# Altium project MSP-EXP430F5529LP.PrjPcb
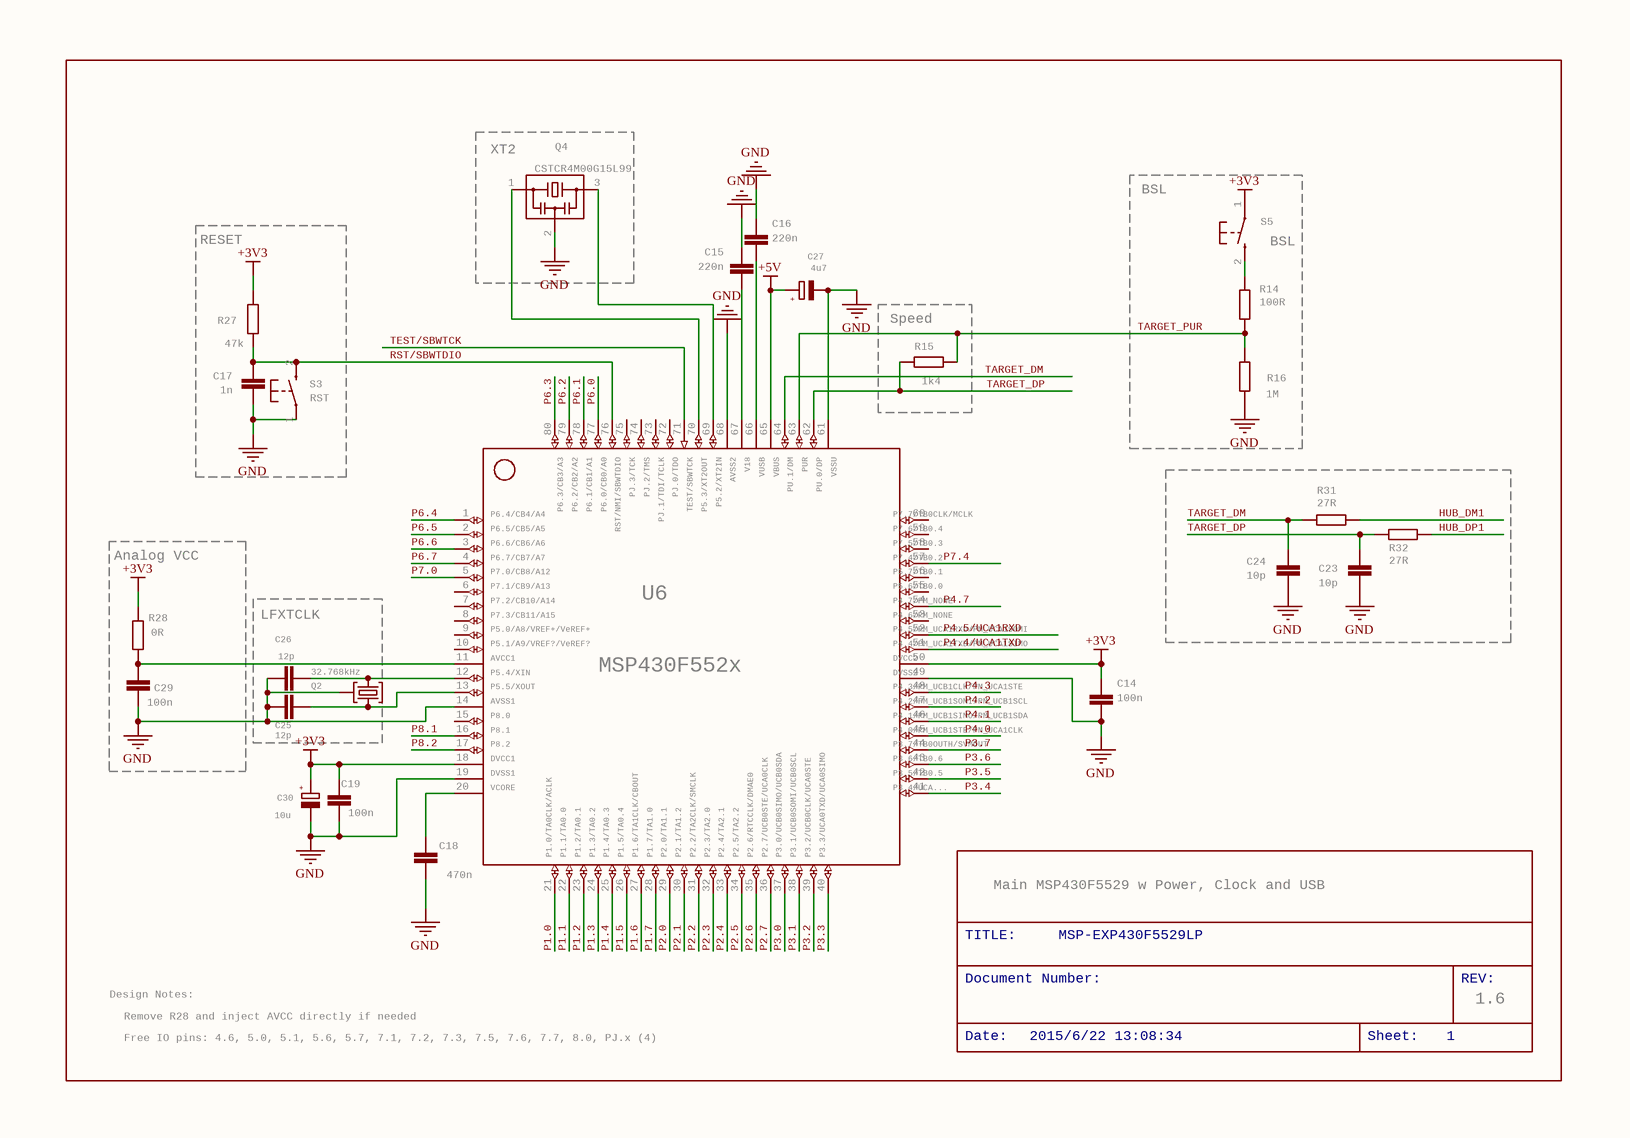
[diagram p0: MSP-EXP430F5529LP_0.SchDoc]
4 sheets, 129 parts. Net scope: global (net labels, ports and power ports of the same name join across sheets).
Board file: MSP-EXP430F5529LP.PcbDoc
Sheets:
  MSP-EXP430F5529LP_0.SchDoc
  MSP-EXP430F5529LP_1.SchDoc
  MSP-EXP430F5529LP_2.SchDoc
  MSP-EXP430F5529LP_3.SchDoc

## Sheet MSP-EXP430F5529LP_0.SchDoc: MSP-EXP430F5529LP
size 286 x 199 mm; Date: 2015/6/22 13:08:34; SheetNumber: 1; Origin: Eagle; GateName_1: G$1; SymbolName_1: DINA4_L; LibraryName: MSP-EXP430F5659; DeviceSetName: DINA4_L; GateName_2: G$2; SymbolName_2: DOCFIELD; Sheet: Sheet:; REV: REV:

### Parts
C14  100n  [0402]
C15  220n  [0402]
C16  220n  [0402]
C17  1n  [0402]
C18  470n  [0402]
C19  100n  [0402]
C23  10p  [0402]
C24  10p  [0402]
C25  12p  [0402]
C26  12p  [0402]
C27  4u7  [A/3216-18R]
C29  100n  [0402]
C30  10u  [A/3216-18R]
Q2  32.768kHz  [MS3V-T1R]
Q4  CSTCR4M00G15L99  [MURATA-FILTER_CSTCR]
R14  100R  [0402]
R15  1k4  [0402]
R16  1M  [0402]
R27  47k  [0402]
R28  0R  [0402]
R31  27R  [0402]
R32  27R  [0402]
S3  RST  [PBTH]
S5  BSL  [PBTH]
U6  MSP430F5529IPNR  [PN80]  (value not drawn)

### Blocks framed on the sheet
XT2: Q4
BSL: R14 R16 S5
RESET: C17 R27 S3
Speed: R15
Analog VCC: C29 R28
LFXTCLK: C25 C26 Q2

### Nets
+3V3: C14.1 C19.2 C30.+ R27.2 R28.2 S5.1(P) U6.18 U6.50
+5V: C27.+ U6.65
GND: C14.2 C15.2 C16.2 C17.2 C18.1 C19.1 C23.2 C24.2 C25.1 C26.1 C27.- C29.2 C30.- Q2.P3(GND) Q4.2 R16.1 S3.1(P) U6.14 U6.19 U6.49 U6.61 U6.68
HUB_DM1: R31.1
HUB_DP1: R32.1
P1.0: U6.21
P1.1: U6.22
P1.2: U6.23
P1.3: U6.24
P1.4: U6.25
P1.5: U6.26
P1.6: U6.27
P1.7: U6.28
P2.0: U6.29
P2.1: U6.30
P2.2: U6.31
P2.3: U6.32
P2.4: U6.33
P2.5: U6.34
P2.6: U6.35
P2.7: U6.36
P3.0: U6.37
P3.1: U6.38
P3.2: U6.39
P3.3: U6.40
P3.4: U6.41
P3.5: U6.42
P3.6: U6.43
P3.7: U6.44
P4.0: U6.45
P4.1: U6.46
P4.2: U6.47
P4.3: U6.48
P4.4/UCA1TXD: U6.51
P4.5/UCA1RXD: U6.52
P4.7: U6.54
P6.0: U6.77
P6.1: U6.78
P6.2: U6.79
P6.3: U6.80
P6.4: U6.1
P6.5: U6.2
P6.6: U6.3
P6.7: U6.4
P7.0: U6.5
P7.4: U6.57
P8.1: U6.16
P8.2: U6.17
RST/SBWTDIO: C17.1 R27.1 S3.2(S) U6.76
TARGET_DM: C24.1 R31.2 U6.64
TARGET_DP: C23.1 R15.2 R32.2 U6.62
TARGET_PUR: R14.2 R15.1 R16.2 U6.63
TEST/SBWTCK: U6.71
NetC15_1: C15.1 U6.67
NetC16_1: C16.1 U6.66
NetC18_2: C18.2 U6.20
NetC25_2: C25.2 Q2.P1 U6.13
NetC26_2: C26.2 Q2.P2 U6.12
NetC29_1: C29.1 R28.1 U6.11
NetQ4_1: Q4.1 U6.70
NetQ4_3: Q4.3 U6.69
NetR14_1: R14.1 S5.2(S)

Not connected (* = marked no-connect by the designer): U6 6 7 8 9 10 15 53 55 56 58 59 60 72 73 74 75

### Notes on the sheet
- TITLE:
- Main MSP430F5529 w Power, Clock and USB
- MSP-EXP430F5529LP
- Design Notes:
- Remove R28 and inject AVCC directly if needed
- Document Number:
- REV:
- 1.6
- Free IO pins: 4.6, 5.0, 5.1, 5.6, 5.7, 7.1, 7.2, 7.3, 7.5, 7.6, 7.7, 8.0, PJ.x (4)
- Date:
- 2015/6/22 13:08:34
- Sheet:
- 1

### Library data of the parts
C14-C19 C23-C26 C29 = C-EUCM0402: CAPACITOR, European symbol; GateName_1: G$1; SymbolName_1: C-EU; DeviceName: CM0402; LibraryName: rcl; DeviceSetName: C-EU
C27 C30 = CPOL-EUA/3216-18R: POLARIZED CAPACITOR, European symbol; GateName_1: G$1; SymbolName_1: CPOL; DeviceName: A/3216-18R; LibraryName: rcl; DeviceSetName: CPOL-EU; +: +
Q2 = MS3V-T1R: GateName_1: >NAME; SymbolName_1: CRYSTAL_W_METALHOUSING; LibraryName: microcrystal; DeviceSetName: MS3V-T1R
Q4 = MURATA-FILTER_CSTCR: Resonator   Source: murata.co.jp; MPN: CSTCR6M00G53-R0; GateName_1: G$1; SymbolName_1: MURATA-FILTER_CST; LibraryName: murata; DeviceSetName: MURATA-FILTER_CSTCR; MF: MF; OC_FARNELL: 1170434; OC_NEWARK: 25M8759
R14-R16 R27 R28 R31 R32 = R-EU_RM0402: RESISTOR, European symbol; GateName_1: G$1; SymbolName_1: R-EU; DeviceName: RM0402; DeviceSetName: R-EU_; LibraryName: rcl
S3 S5 = PB: OMRON SWITCH; GateName_1: G$1; SymbolName_1: PB; LibraryName: electricalmeter; DeviceSetName: PB
U6 = F552X---PN80: ***MSP430F552X***PN80 http://www.ti.com/lit/gpn/msp430f5529 Rev1.0 06/2010    For F552X where X is 1,5,7,9; GateName_1: G$1; SymbolName_1: F552X---PN80; LibraryName: TI_MSP430_v16_intern; DeviceSetName: F552X---PN80; P6.3/CB3/A3: P6.3/CB3/A3; P6.2/CB2/A2: P6.2/CB2/A2; P6.1/CB1/A1: P6.1/CB1/A1; P6.0/CB0/A0: P6.0/CB0/A0; PJ.3/TCK: PJ.3/TCK; PJ.2/TMS: PJ.2/TMS; PJ.1/TDI/TCLK: PJ.1/TDI/TCLK; PJ.0/TDO: PJ.0/TDO; TEST/SBWTCK: TEST/SBWTCK; P5.3/XT2OUT: P5.3/XT2OUT; P5.2/XT2IN: P5.2/XT2IN; AVSS2: AVSS2; V18: V18; VUSB: VUSB; VBUS: VBUS; PU.1/DM: PU.1/DM; PUR: PUR; PU.0/DP: PU.0/DP; VSSU: VSSU; RST/NMI/SBWTDIO: RST/NMI/SBWTDIO; P7.7/TB0CLK/MCLK: P7.7/TB0CLK/MCLK; P7.6/TB0.4: P7.6/TB0.4; P7.5/TB0.3: P7.5/TB0.3; P7.4/TB0.2: P7.4/TB0.2; P5.7/TB0.1: P5.7/TB0.1; P5.6/TB0.0: P5.6/TB0.0; P4.7/PM_NONE: P4.7/PM_NONE; P4.5/PM_UCA1RXD/PM_UCA1SOMI: P4.5/PM_UCA1RXD/PM_UCA1SOMI; P4.4/PM_UCA1TXD/PM_UCA1SIMO: P4.4/PM_UCA1TXD/PM_UCA1SIMO; DVCC2: DVCC2; P4.3/PM_UCB1CLK/PM_UCA1STE: P4.3/PM_UCB1CLK/PM_UCA1STE; P4.2/PM_UCB1SOMI/PM_UCB1SCL: P4.2/PM_UCB1SOMI/PM_UCB1SCL; P4.1/PM_UCB1SIMO/PM_UCB1SDA: P4.1/PM_UCB1SIMO/PM_UCB1SDA; P4.0/PM_UCB1STE/PM_UCA1CLK: P4.0/PM_UCB1STE/PM_UCA1CLK; P3.7/TB0OUTH/SVMOUT: P3.7/TB0OUTH/SVMOUT; P3.6/TB0.6: P3.6/TB0.6; P4.6/PM_NONE: P4.6/PM_NONE; P3.5/TB0.5: P3.5/TB0.5; P3.4/UCA...: P3.4/UCA...; P1.0/TA0CLK/ACLK: P1.0/TA0CLK/ACLK; P1.1/TA0.0: P1.1/TA0.0; P1.2/TA0.1: P1.2/TA0.1; P1.3/TA0.2: P1.3/TA0.2; P1.4/TA0.3: P1.4/TA0.3; P1.5/TA0.4: P1.5/TA0.4; P1.6/TA1CLK/CBOUT: P1.6/TA1CLK/CBOUT; P1.7/TA1.0: P1.7/TA1.0; P2.0/TA1.1: P2.0/TA1.1; P2.1/TA1.2: P2.1/TA1.2; P2.2/TA2CLK/SMCLK: P2.2/TA2CLK/SMCLK; P2.4/TA2.1: P2.4/TA2.1; P2.5/TA2.2: P2.5/TA2.2; P2.6/RTCCLK/DMAE0: P2.6/RTCCLK/DMAE0; P2.7/UCB0STE/UCA0CLK: P2.7/UCB0STE/UCA0CLK; P3.0/UCB0SIMO/UCB0SDA: P3.0/UCB0SIMO/UCB0SDA; P3.1/UCB0SOMI/UCB0SCL: P3.1/UCB0SOMI/UCB0SCL; P3.2/UCB0CLK/UCA0STE: P3.2/UCB0CLK/UCA0STE; P3.3/UCA0TXD/UCA0SIMO: P3.3/UCA0TXD/UCA0SIMO; P6.4/CB4/A4: P6.4/CB4/A4; P6.5/CB5/A5: P6.5/CB5/A5; P6.6/CB6/A6: P6.6/CB6/A6; P6.7/CB7/A7: P6.7/CB7/A7; P7.0/CB8/A12: P7.0/CB8/A12; P7.1/CB9/A13: P7.1/CB9/A13; P7.2/CB10/A14: P7.2/CB10/A14; P7.3/CB11/A15: P7.3/CB11/A15; P5.0/A8/VREF+/VeREF+: P5.0/A8/VREF+/VeREF+; P5.1/A9/VREF?/VeREF?: P5.1/A9/VREF?/VeREF?; AVCC1: AVCC1; P5.4/XIN: P5.4/XIN; P5.5/XOUT: P5.5/XOUT; AVSS1: AVSS1; P8.0: P8.0; P8.1: P8.1; P8.2: P8.2; DVCC1: DVCC1; DVSS1: DVSS1; VCORE: VCORE; MSP430F552x: MSP430F552x; DVSS2: DVSS2; P2.3/TA2.0: P2.3/TA2.0

## Sheet MSP-EXP430F5529LP_1.SchDoc: MSP-EXP430F5529LP
size 286 x 199 mm; Date: 2015/6/22 13:08:34; SheetNumber: 2; Origin: Eagle; GateName_1: G$1; SymbolName_1: DINA4_L; LibraryName: MSP-EXP430F5659; DeviceSetName: DINA4_L; GateName_2: G$2; SymbolName_2: DOCFIELD; Sheet: Sheet:; REV: REV:
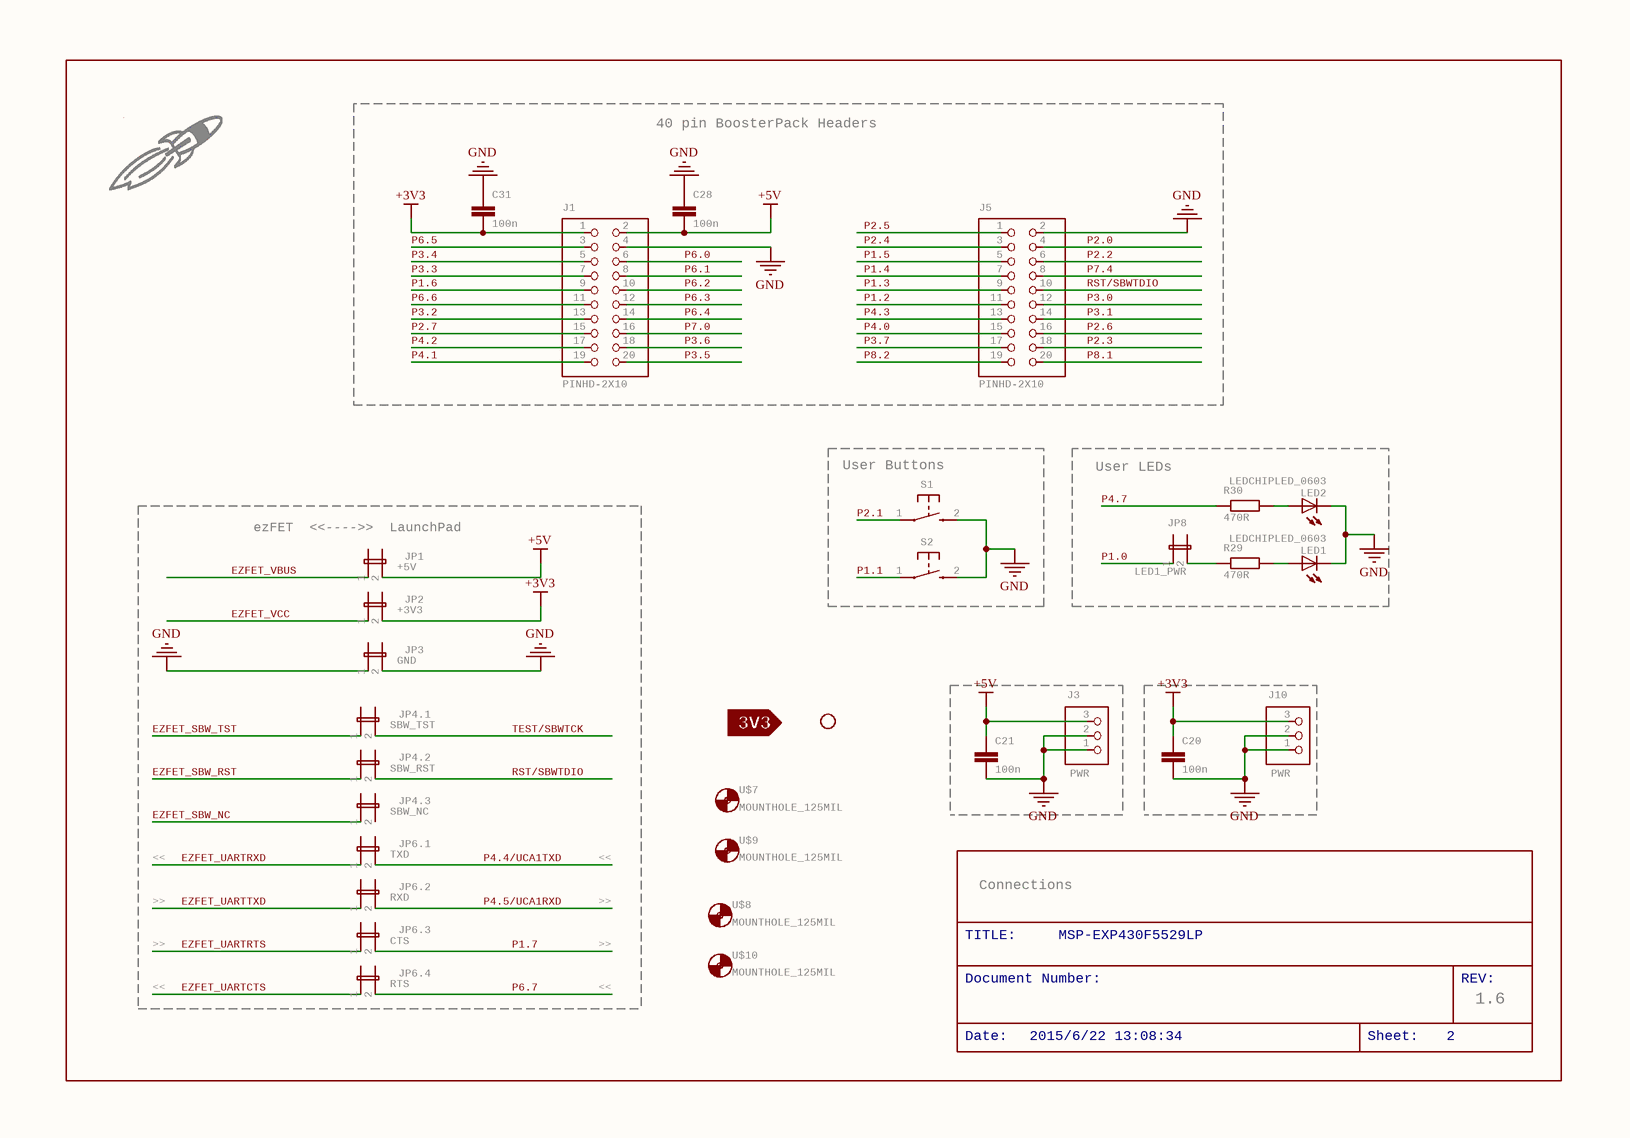
[diagram p1: MSP-EXP430F5529LP_1.SchDoc]

### Parts
C20  100n  [0402]
C21  100n  [0402]
C28  100n  [0402]
C31  100n  [0402]
DRAW1  LOGO-ROCKET-20X13MM-SCH-S  [LOGO-ROCKET-10X7MM-BRD]  (value not drawn)
J1  PINHD-2X10  [2X10]
J3  PWR  [1X03]
J5  PINHD-2X10  [2X10]
J10  PWR  [1X03]
JP1  +5V  [JP1M]
JP2  +3V3  [JP1M]
JP3  GND  [JP1M]
JP4.1  SBW_TST  [JP1M]
JP4.2  SBW_RST  [JP1M]
JP4.3  SBW_NC  [JP1M]
JP6.1  TXD  [JP1M]
JP6.2  RXD  [JP1M]
JP6.3  CTS  [JP1M]
JP6.4  RTS  [JP1M]
JP8  LED1_PWR  [JP1]
LED1  LEDCHIPLED_0603  [CHIPLED_0603]
LED2  LEDCHIPLED_0603  [CHIPLED_0603]
R29  470R  [0402]
R30  470R  [0402]
S1  PB  [PBTH]  (value not drawn)
S2  PB  [PBTH]  (value not drawn)
U$4  MS_TM  [MS_TM]  (value not drawn)
U$6  SILK_3V3_TAG  [SILK_3V3_TAG]  (value not drawn)
U$7  MOUNTHOLE_125MIL  [MOUNTHOLE_125MIL]
U$8  MOUNTHOLE_125MIL  [MOUNTHOLE_125MIL]
U$9  MOUNTHOLE_125MIL  [MOUNTHOLE_125MIL]
U$10  MOUNTHOLE_125MIL  [MOUNTHOLE_125MIL]
U$11  5529LP_REARSILK_REV1_6  [5529LP_REARSILK_REV1_6]  (value not drawn)

### Blocks framed on the sheet
40 pin BoosterPack Headers: C28 C31 J1 J5
User Buttons: S1 S2
User LEDs: JP8 LED1 LED2 R29 R30
ezFET  <<---->>  LaunchPad: JP1-JP3 JP4.1-JP4.3 JP6.1-JP6.4

### Nets
+3V3: C20.1 C31.2 J1.1 J10.3 JP2.2
+5V: C21.1 C28.2 J1.2 J3.3 JP1.2
GND: C20.2 C21.2 C28.1 C31.1 J1.4 J3.1 J3.2 J5.2 J10.1 J10.2 JP3.1 JP3.2 LED1.C LED2.C S1.2(S) S2.2(S)
EZFET_SBW_NC: JP4.3.1
EZFET_SBW_RST: JP4.2.1
EZFET_SBW_TST: JP4.1.1
EZFET_UARTCTS: JP6.4.1
EZFET_UARTRTS: JP6.3.1
EZFET_UARTRXD: JP6.1.1
EZFET_UARTTXD: JP6.2.1
EZFET_VBUS: JP1.1
EZFET_VCC: JP2.1
P1.0: JP8.1
P1.1: S2.1(P)
P1.2: J5.11
P1.3: J5.9
P1.4: J5.7
P1.5: J5.5
P1.6: J1.9
P1.7: JP6.3.2
P2.0: J5.4
P2.1: S1.1(P)
P2.2: J5.6
P2.3: J5.18
P2.4: J5.3
P2.5: J5.1
P2.6: J5.16
P2.7: J1.15
P3.0: J5.12
P3.1: J5.14
P3.2: J1.13
P3.3: J1.7
P3.4: J1.5
P3.5: J1.20
P3.6: J1.18
P3.7: J5.17
P4.0: J5.15
P4.1: J1.19
P4.2: J1.17
P4.3: J5.13
P4.4/UCA1TXD: JP6.1.2
P4.5/UCA1RXD: JP6.2.2
P4.7: R30.1
P6.0: J1.6
P6.1: J1.8
P6.2: J1.10
P6.3: J1.12
P6.4: J1.14
P6.5: J1.3
P6.6: J1.11
P6.7: JP6.4.2
P7.0: J1.16
P7.4: J5.8
P8.1: J5.20
P8.2: J5.19
RST/SBWTDIO: J5.10 JP4.2.2
TEST/SBWTCK: JP4.1.2
NetJP8_2: JP8.2 R29.1
NetLED1_A: LED1.A R29.2
NetLED2_A: LED2.A R30.2

Not connected (* = marked no-connect by the designer): JP4.3 2

### Notes on the sheet
- <<
- >>
- TITLE:
- Connections
- MSP-EXP430F5529LP
- Document Number:
- REV:
- 1.6
- Date:
- 2015/6/22 13:08:34
- Sheet:
- 2

### Library data of the parts
C20 C21 C28 C31 = C-EUCM0402: as C14 on sheet MSP-EXP430F5529LP_0; LibraryName: rcl; DeviceSetName: C-EU
DRAW1 = LOGO-ROCKET-20X13MM-SCH-S: TI LaunchPad Rocket for Schematic and Layout   Based on TI's LaunchPad Rocket from www.ti.com/LaunchPad   Usage:  Place this component in the Eagle Schematic  This symbol has a footprint too, so it will show up in the layout too  There are different sizes / footprints available  The PCB symbol size can be changed via package in schematic or the layout       As far as I know the LaunchPad rocket is released by TI under the Creative Commons license.    Check for updates and leave me feedback: github.com/ucdude  Happy hacking - ucDude, Nov 2012; GateName_1: G$1; SymbolName_1: LOGO-ROCKET-20X13MM-SYM; DeviceName: -S; LibraryName: TI-LaunchPad-Eagle; DeviceSetName: LOGO-ROCKET-20X13MM-SCH
J1 J5 = PINHD-2X10: PIN HEADER; GateName_1: A; SymbolName_1: PINH2X10; LibraryName: pinhead; DeviceSetName: PINHD-2X10
J3 J10 = PINHD-1X3: PIN HEADER; GateName_1: A; SymbolName_1: PINHD3; LibraryName: pinhead; DeviceSetName: PINHD-1X3
JP1-JP3 JP4.1-JP4.3 JP6.1-JP6.4 = JP1M: GateName_1: G$1; SymbolName_1: JP2E; LibraryName: jumper; DeviceSetName: JP1M
JP8 = JP1E: JUMPER; GateName_1: A; SymbolName_1: JP2E; LibraryName: jumper; DeviceSetName: JP1E
LED1 LED2 = LEDCHIPLED_0603: LED   OSRAM: - CHIPLED LG R971, LG N971, LY N971, LG Q971, LY Q971, LO R971, LY R971 LH N974, LH R974 LS Q976, LO Q976, LY Q976 LO Q996 - Hyper CHIPLED LW Q18S LB Q993, LB Q99A, LB R99A - SideLED LS A670, LO A670, LY A670, LG A670, LP A670 LB A673, LV A673, LT A673, LW A673 LH A674 LY A675 LS A676, LA A676, LO A676, LY A676, LW A676 LS A679, LY A679, LG A679 -  Hyper Micro SIDELED庐 LS Y876, LA Y876, LO Y876, LY Y876 LT Y87S - SmartLED LW L88C, LW L88S LB L89C, LB L89S, LG L890 LS L89K, LO L89K, LY L89K LS L896, LA L896, LO L896, LY L896 - TOPLED LS T670, LO T670, LY T670, LG T670, LP T670 LSG T670, LSP T670, LSY T670, LOP T670, LYG T670 LG T671, LOG T671, LSG T671 LB T673, LV T673, LT T673, LW T673 LH T674 LS T676, LA T676, LO T676, LY T676, LB T676, LH T676, LSB T676, LW T676 LB T67C, LV T67C, LT T67C, LS T67K, LO T67K, LY T67K, LW E67C LS E67B, LA E67B, LO E67B, LY E67B, LB E67C, LV E67C, LT E67C LW T67C LS T679, LY T679, LG T679 LS T770, LO T770, LY T770, LG T770, LP T770 LB T773, LV T773, LT T773, LW T773 LH T774 LS E675, LA E675, LY E675, LS T675 LS T776, LA T776, LO T776, LY T776, LB T776 LHGB T686 LT T68C, LB T68C - Hyper Mini TOPLED庐 LB M676 - Mini TOPLED Santana庐 LG M470 LS M47K, LO M47K, LY M47K    Source: http://www.osram.convergy.de   LUXEON: - LUMILED庐 LXK2-PW12-R00, LXK2-PW12-S00, LXK2-PW14-U00, LXK2-PW14-V00 LXK2-PM12-R00, LXK2-PM12-S00, LXK2-PM14-U00 LXK2-PE12-Q00, LXK2-PE12-R00, LXK2-PE12-S00, LXK2-PE14-T00, LXK2-PE14-U00 LXK2-PB12-K00, LXK2-PB12-L00, LXK2-PB12-M00, LXK2-PB14-N00, LXK2-PB14-P00, LXK2-PB14-Q00 LXK2-PR12-L00, LXK2-PR12-M00, LXK2-PR14-Q00, LXK2-PR14-R00 LXK2-PD12-Q00, LXK2-PD12-R00, LXK2-PD12-S00 LXK2-PH12-R00, LXK2-PH12-S00 LXK2-PL12-P00, LXK2-PL12-Q00, LXK2-PL12-R00    Source: www.luxeon.com   KINGBRIGHT:   KA-3528ASYC Source: www.kingbright.com; GateName_1: G$1; SymbolName_1: LED; DeviceName: CHIPLED_0603; LibraryName: led; DeviceSetName: LED
R29 R30 = R-EU_RM0402: as R14 on sheet MSP-EXP430F5529LP_0; LibraryName: rcl
S1 S2 = PB: OMRON SWITCH; GateName_1: G$1; SymbolName_1: PB; LibraryName: electricalmeter; DeviceSetName: PB
U$4 = MS_TM: GateName_1: G$1; SymbolName_1: SILKSCREEN; LibraryName: LP_Silkscreen; DeviceSetName: MS_TM
U$6 = SILK_3V3_TAG: GateName_1: G$1; SymbolName_1: 3V3_TAG; LibraryName: MSP-EXP432; DeviceSetName: SILK_3V3_TAG
U$7-U$10 = MOUNTHOLE_125MIL: GateName_1: A; SymbolName_1: MOUNTHOLE_125MIL; LibraryName: MSP-EXP432; DeviceSetName: MOUNTHOLE_125MIL
U$11 = 5529LP_REARSILK_REV1_6: GateName_1: G$1; SymbolName_1: SILK; LibraryName: Silk; DeviceSetName: 5529LP_REARSILK_REV1_6

## Sheet MSP-EXP430F5529LP_2.SchDoc: MSP-EXP430F5529LP
size 286 x 199 mm; Date: 2015/6/22 13:08:34; SheetNumber: 3; Origin: Eagle; GateName_1: G$1; SymbolName_1: DINA4_L; LibraryName: MSP-EXP430F5659; DeviceSetName: DINA4_L; GateName_2: G$2; SymbolName_2: DOCFIELD; Sheet: Sheet:; REV: REV:
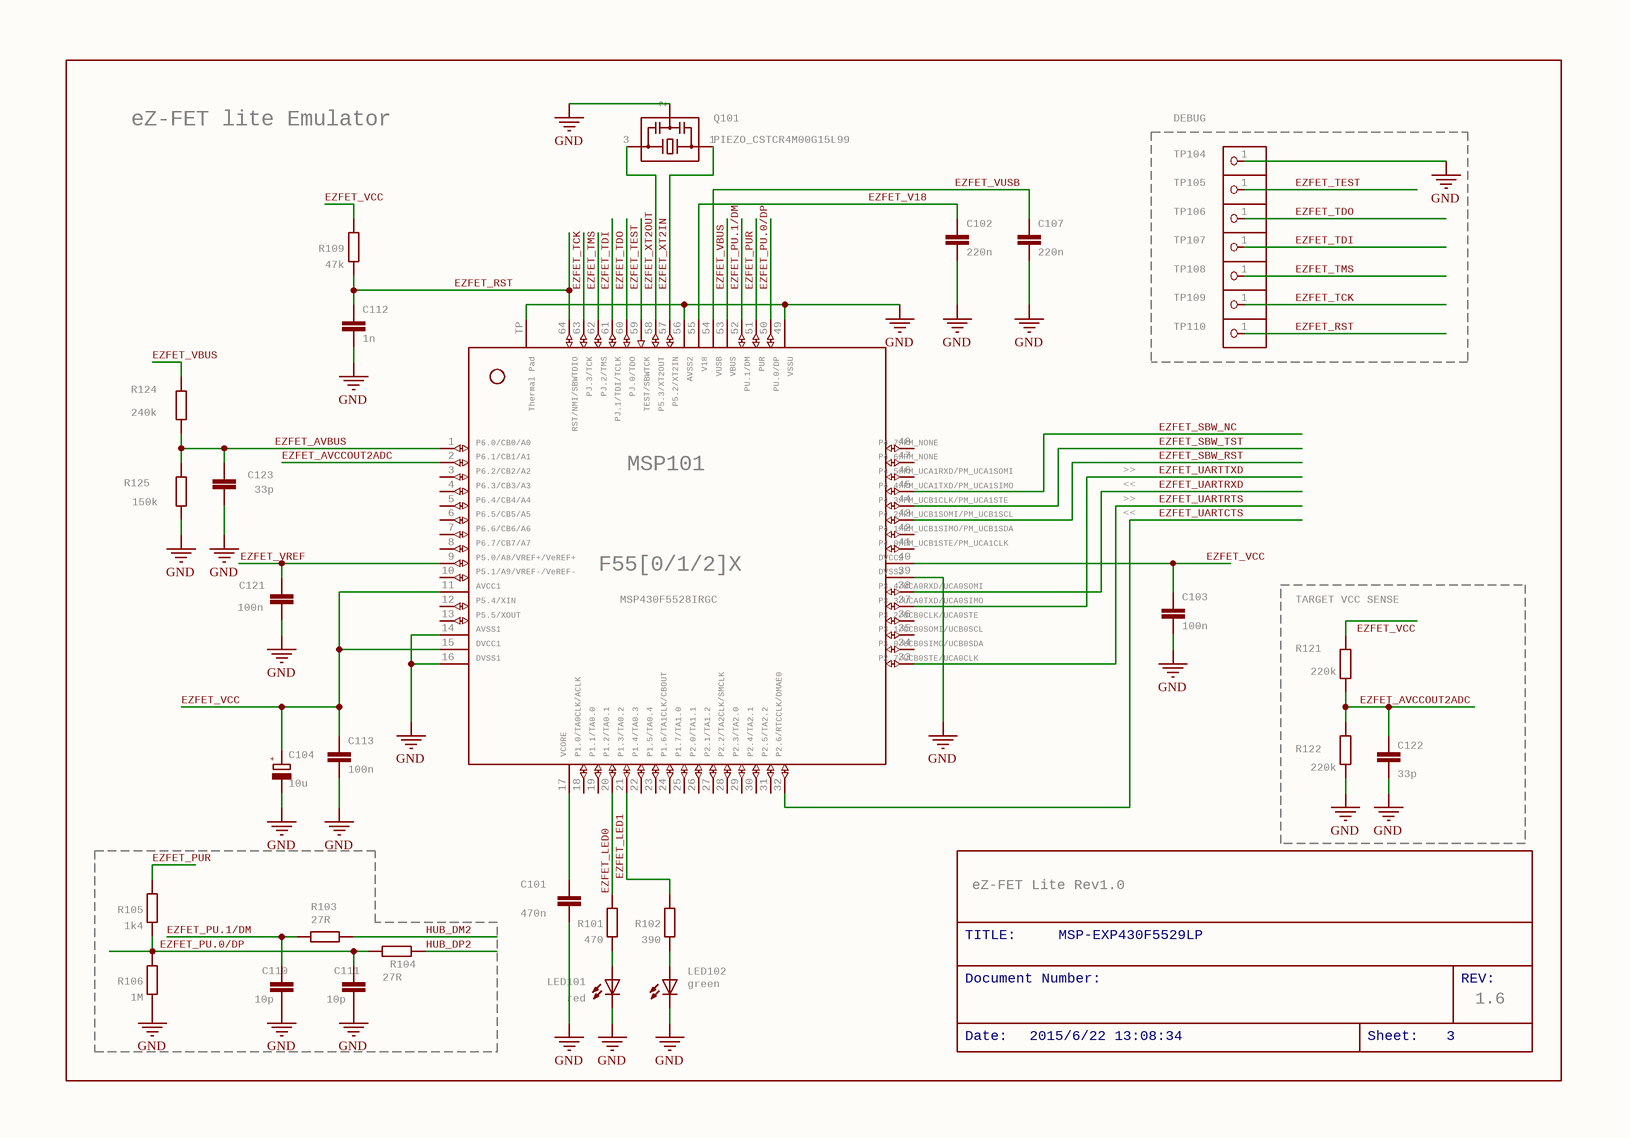
[diagram p2: MSP-EXP430F5529LP_2.SchDoc]

### Parts
C101  470n  [0402]
C102  220n  [0402]
C103  100n  [0402]
C104  10u  [A/3216-18R]
C107  220n  [0402]
C110  10p  [0402]
C111  10p  [0402]
C112  1n  [0402]
C113  100n  [0402]
C121  100n  [0402]
C122  33p  [0402]
C123  33p  [0402]
LED101  red  [CHIP-LED0603]
LED102  green  [CHIP-LED0603]
MSP101  ThermalPad: Thermal Pad  [RGC64]  (hidden comment: MSP430F5528IRGC)
Q101  PIEZO_CSTCR4M00G15L99  [MURATA-FILTER_CSTCR]
R101  470  [0402]
R102  390  [0402]
R103  27R  [0402]
R104  27R  [0402]
R105  1k4  [0402]
R106  1M  [0402]
R109  47k  [0402]
R121  220k  [0402]
R122  220k  [0402]
R124  240k  [0402]
R125  150k  [0402]
TP104  TEST_PIN2  [1X01]  (value not drawn)
TP105  TEST_PIN2  [1X01]  (value not drawn)
TP106  TEST_PIN2  [1X01]  (value not drawn)
TP107  TEST_PIN2  [1X01]  (value not drawn)
TP108  TEST_PIN2  [1X01]  (value not drawn)
TP109  TEST_PIN2  [1X01]  (value not drawn)
TP110  TEST_PIN2  [1X01]  (value not drawn)

### Blocks framed on the sheet
DEBUG: TP104-TP110
TARGET VCC SENSE: C122 R121 R122

### Nets
GND: C101.2 C102.2 C103.2 C104.- C107.2 C110.2 C111.2 C112.2 C113.2 C121.2 C122.1 C123.1 LED101.C LED102.C MSP101.14 MSP101.16 MSP101.39 MSP101.49 MSP101.56 MSP101.TP Q101.2 R106.1 R122.2 R125.2 TP104.1
EZFET_AVBUS: C123.2 MSP101.1 R124.2 R125.1
EZFET_AVCCOUT2ADC: C122.2 MSP101.2 R121.2 R122.1
EZFET_LED0: MSP101.20 R101.2
EZFET_LED1: MSP101.21 R102.2
EZFET_PU.0/DP: C111.1 MSP101.50 R104.2 R105.1 R106.2
EZFET_PU.1/DM: C110.1 MSP101.52 R103.2
EZFET_PUR: MSP101.51 R105.2
EZFET_RST: C112.1 MSP101.64 R109.1 TP110.1
EZFET_SBW_NC: MSP101.45
EZFET_SBW_RST: MSP101.43
EZFET_SBW_TST: MSP101.44
EZFET_TCK: MSP101.63 TP109.1
EZFET_TDI: MSP101.61 TP107.1
EZFET_TDO: MSP101.60 TP106.1
EZFET_TEST: MSP101.59 TP105.1
EZFET_TMS: MSP101.62 TP108.1
EZFET_UARTCTS: MSP101.32
EZFET_UARTRTS: MSP101.33
EZFET_UARTRXD: MSP101.38
EZFET_UARTTXD: MSP101.37
EZFET_V18: C102.1 MSP101.55
EZFET_VBUS: MSP101.53 R124.1
EZFET_VCC: C103.1 C104.+ C113.1 MSP101.11 MSP101.15 MSP101.40 R109.2 R121.1
EZFET_VREF: C121.1 MSP101.9
EZFET_VUSB: C107.1 MSP101.54
EZFET_XT2IN: MSP101.57 Q101.1
EZFET_XT2OUT: MSP101.58 Q101.3
HUB_DM2: R103.1
HUB_DP2: R104.1
NetC101_1: C101.1 MSP101.17
NetLED101_A: LED101.A R101.1
NetLED102_A: LED102.A R102.1

Not connected (* = marked no-connect by the designer): MSP101 3 4 5 6 7 8 10 12 13 18 19 22 23 24 25 26 27 28 29 30 31 34 35 36 41 42 46 47 48

### Notes on the sheet
- eZ-FET lite Emulator
- >>
- <<
- (near MSP101) MSP430F5528IRGC
- TITLE:
- eZ-FET Lite Rev1.0
- MSP-EXP430F5529LP
- Document Number:
- REV:
- 1.6
- Date:
- 2015/6/22 13:08:34
- Sheet:
- 3

### Library data of the parts
C101-C103 C107 C110-C113 C121-C123 = C-EUCM0402: as C14 on sheet MSP-EXP430F5529LP_0; LibraryName: rcl; DeviceSetName: C-EU
C104 = CPOL-EUA/3216-18R: as C27 on sheet MSP-EXP430F5529LP_0; DeviceName: A/3216-18R; LibraryName: rcl; DeviceSetName: CPOL-EU; +: +
LED101 LED102 = LEDCHIP-LED0603: LED   OSRAM: - CHIPLED LG R971, LG N971, LY N971, LG Q971, LY Q971, LO R971, LY R971 LH N974, LH R974 LS Q976, LO Q976, LY Q976 LO Q996 - Hyper CHIPLED LW Q18S LB Q993, LB Q99A, LB R99A - SideLED LS A670, LO A670, LY A670, LG A670, LP A670 LB A673, LV A673, LT A673, LW A673 LH A674 LY A675 LS A676, LA A676, LO A676, LY A676, LW A676 LS A679, LY A679, LG A679 -  Hyper Micro SIDELED庐 LS Y876, LA Y876, LO Y876, LY Y876 LT Y87S - SmartLED LW L88C, LW L88S LB L89C, LB L89S, LG L890 LS L89K, LO L89K, LY L89K LS L896, LA L896, LO L896, LY L896 - TOPLED LS T670, LO T670, LY T670, LG T670, LP T670 LSG T670, LSP T670, LSY T670, LOP T670, LYG T670 LG T671, LOG T671, LSG T671 LB T673, LV T673, LT T673, LW T673 LH T674 LS T676, LA T676, LO T676, LY T676, LB T676, LH T676, LSB T676, LW T676 LB T67C, LV T67C, LT T67C, LS T67K, LO T67K, LY T67K, LW E67C LS E67B, LA E67B, LO E67B, LY E67B, LB E67C, LV E67C, LT E67C LW T67C LS T679, LY T679, LG T679 LS T770, LO T770, LY T770, LG T770, LP T770 LB T773, LV T773, LT T773, LW T773 LH T774 LS E675, LA E675, LY E675, LS T675 LS T776, LA T776, LO T776, LY T776, LB T776 LHGB T686 LT T68C, LB T68C - Hyper Mini TOPLED庐 LB M676 - Mini TOPLED Santana庐 LG M470 LS M47K, LO M47K, LY M47K    Source: http://www.osram.convergy.de   LUXEON: - LUMILED庐 LXK2-PW12-R00, LXK2-PW12-S00, LXK2-PW14-U00, LXK2-PW14-V00 LXK2-PM12-R00, LXK2-PM12-S00, LXK2-PM14-U00 LXK2-PE12-Q00, LXK2-PE12-R00, LXK2-PE12-S00, LXK2-PE14-T00, LXK2-PE14-U00 LXK2-PB12-K00, LXK2-PB12-L00, LXK2-PB12-M00, LXK2-PB14-N00, LXK2-PB14-P00, LXK2-PB14-Q00 LXK2-PR12-L00, LXK2-PR12-M00, LXK2-PR14-Q00, LXK2-PR14-R00 LXK2-PD12-Q00, LXK2-PD12-R00, LXK2-PD12-S00 LXK2-PH12-R00, LXK2-PH12-S00 LXK2-PL12-P00, LXK2-PL12-Q00, LXK2-PL12-R00    Source: www.luxeon.com   KINGBRIGHT:   KA-3528ASYC Source: www.kingbright.com; GateName_1: G$1; SymbolName_1: LED; DeviceName: CHIP-LED0603; LibraryName: led; DeviceSetName: LED
MSP101 = F55[0/1/2]X---RGC64: ***F55[0/1/2]X***RGC64 Rev. 1.0 06/2010 "http://www.ti.com/lit/gpn/msp430f5529" "http://www.ti.com/lit/gpn/msp430f5509" F5513/F5514 with limited Functions on some Pins; GateName_1: G$1; SymbolName_1: F55[0/1/2]X---RGC64; LibraryName: TI_MSP430_v16_intern; DeviceSetName: F55[0/1/2]X---RGC64; RST/NMI/SBWTDIO: RST/NMI/SBWTDIO; PJ.3/TCK: PJ.3/TCK; PJ.2/TMS: PJ.2/TMS; PJ.1/TDI/TCLK: PJ.1/TDI/TCLK; PJ.0/TDO: PJ.0/TDO; TEST/SBWTCK: TEST/SBWTCK; P5.3/XT2OUT: P5.3/XT2OUT; P5.2/XT2IN: P5.2/XT2IN; AVSS2: AVSS2; V18: V18; VUSB: VUSB; VBUS: VBUS; PU.1/DM: PU.1/DM; PUR: PUR; PU.0/DP: PU.0/DP; VSSU: VSSU; P6.0/CB0/A0: P6.0/CB0/A0; P6.1/CB1/A1: P6.1/CB1/A1; P6.2/CB2/A2: P6.2/CB2/A2; P6.3/CB3/A3: P6.3/CB3/A3; P6.4/CB4/A4: P6.4/CB4/A4; P6.5/CB5/A5: P6.5/CB5/A5; P6.6/CB6/A6: P6.6/CB6/A6; P6.7/CB7/A7: P6.7/CB7/A7; P5.0/A8/VREF+/VeREF+: P5.0/A8/VREF+/VeREF+; P5.1/A9/VREF-/VeREF-: P5.1/A9/VREF-/VeREF-; AVCC1: AVCC1; P5.4/XIN: P5.4/XIN; P5.5/XOUT: P5.5/XOUT; AVSS1: AVSS1; DVCC1: DVCC1; DVSS1: DVSS1; VCORE: VCORE; P1.0/TA0CLK/ACLK: P1.0/TA0CLK/ACLK; P1.1/TA0.0: P1.1/TA0.0; P1.2/TA0.1: P1.2/TA0.1; P1.3/TA0.2: P1.3/TA0.2; P1.4/TA0.3: P1.4/TA0.3; P1.5/TA0.4: P1.5/TA0.4; P1.6/TA1CLK/CBOUT: P1.6/TA1CLK/CBOUT; P1.7/TA1.0: P1.7/TA1.0; P2.0/TA1.1: P2.0/TA1.1; P2.1/TA1.2: P2.1/TA1.2; P2.2/TA2CLK/SMCLK: P2.2/TA2CLK/SMCLK; P2.3/TA2.0: P2.3/TA2.0; P2.4/TA2.1: P2.4/TA2.1; P2.5/TA2.2: P2.5/TA2.2; P2.6/RTCCLK/DMAE0: P2.6/RTCCLK/DMAE0; P4.7/PM_NONE: P4.7/PM_NONE; P4.6/PM_NONE: P4.6/PM_NONE; P4.5/PM_UCA1RXD/PM_UCA1SOMI: P4.5/PM_UCA1RXD/PM_UCA1SOMI; P4.4/PM_UCA1TXD/PM_UCA1SIMO: P4.4/PM_UCA1TXD/PM_UCA1SIMO; P4.3/PM_UCB1CLK/PM_UCA1STE: P4.3/PM_UCB1CLK/PM_UCA1STE; P4.2/PM_UCB1SOMI/PM_UCB1SCL: P4.2/PM_UCB1SOMI/PM_UCB1SCL; P4.1/PM_UCB1SIMO/PM_UCB1SDA: P4.1/PM_UCB1SIMO/PM_UCB1SDA; P4.0/PM_UCB1STE/PM_UCA1CLK: P4.0/PM_UCB1STE/PM_UCA1CLK; DVCC2: DVCC2; DVSS2: DVSS2; P3.4/UCA0RXD/UCA0SOMI: P3.4/UCA0RXD/UCA0SOMI; P3.3/UCA0TXD/UCA0SIMO: P3.3/UCA0TXD/UCA0SIMO; P3.2/UCB0CLK/UCA0STE: P3.2/UCB0CLK/UCA0STE; P3.1/UCB0SOMI/UCB0SCL: P3.1/UCB0SOMI/UCB0SCL; P3.0/UCB0SIMO/UCB0SDA: P3.0/UCB0SIMO/UCB0SDA; P2.7/UCB0STE/UCA0CLK: P2.7/UCB0STE/UCA0CLK; F55[0/1/2]X: F55[0/1/2]X
Q101 = MURATA-FILTER_CSTCR: as Q4 on sheet MSP-EXP430F5529LP_0; SymbolName_1: MURATA-FILTER_CST; LibraryName: murata; DeviceSetName: MURATA-FILTER_CSTCR; MF: MF; OC_FARNELL: 1170434; OC_NEWARK: 25M8759
R101-R106 R109 R121 R122 R124 R125 = R-EU_RM0402: as R14 on sheet MSP-EXP430F5529LP_0; LibraryName: rcl
TP104-TP110 = PINHD-1X1: PIN HEADER; GateName_1: G$1; SymbolName_1: PINHD1; LibraryName: pinhead; DeviceSetName: PINHD-1X1

## Sheet MSP-EXP430F5529LP_3.SchDoc: MSP-EXP430F5529LP
size 286 x 199 mm; Date: 2015/6/22 13:08:34; SheetNumber: 4; Origin: Eagle; GateName_1: G$1; SymbolName_1: DINA4_L; LibraryName: MSP-EXP430F5659; DeviceSetName: DINA4_L; GateName_2: G$2; SymbolName_2: DOCFIELD; Sheet: Sheet:; REV: REV:
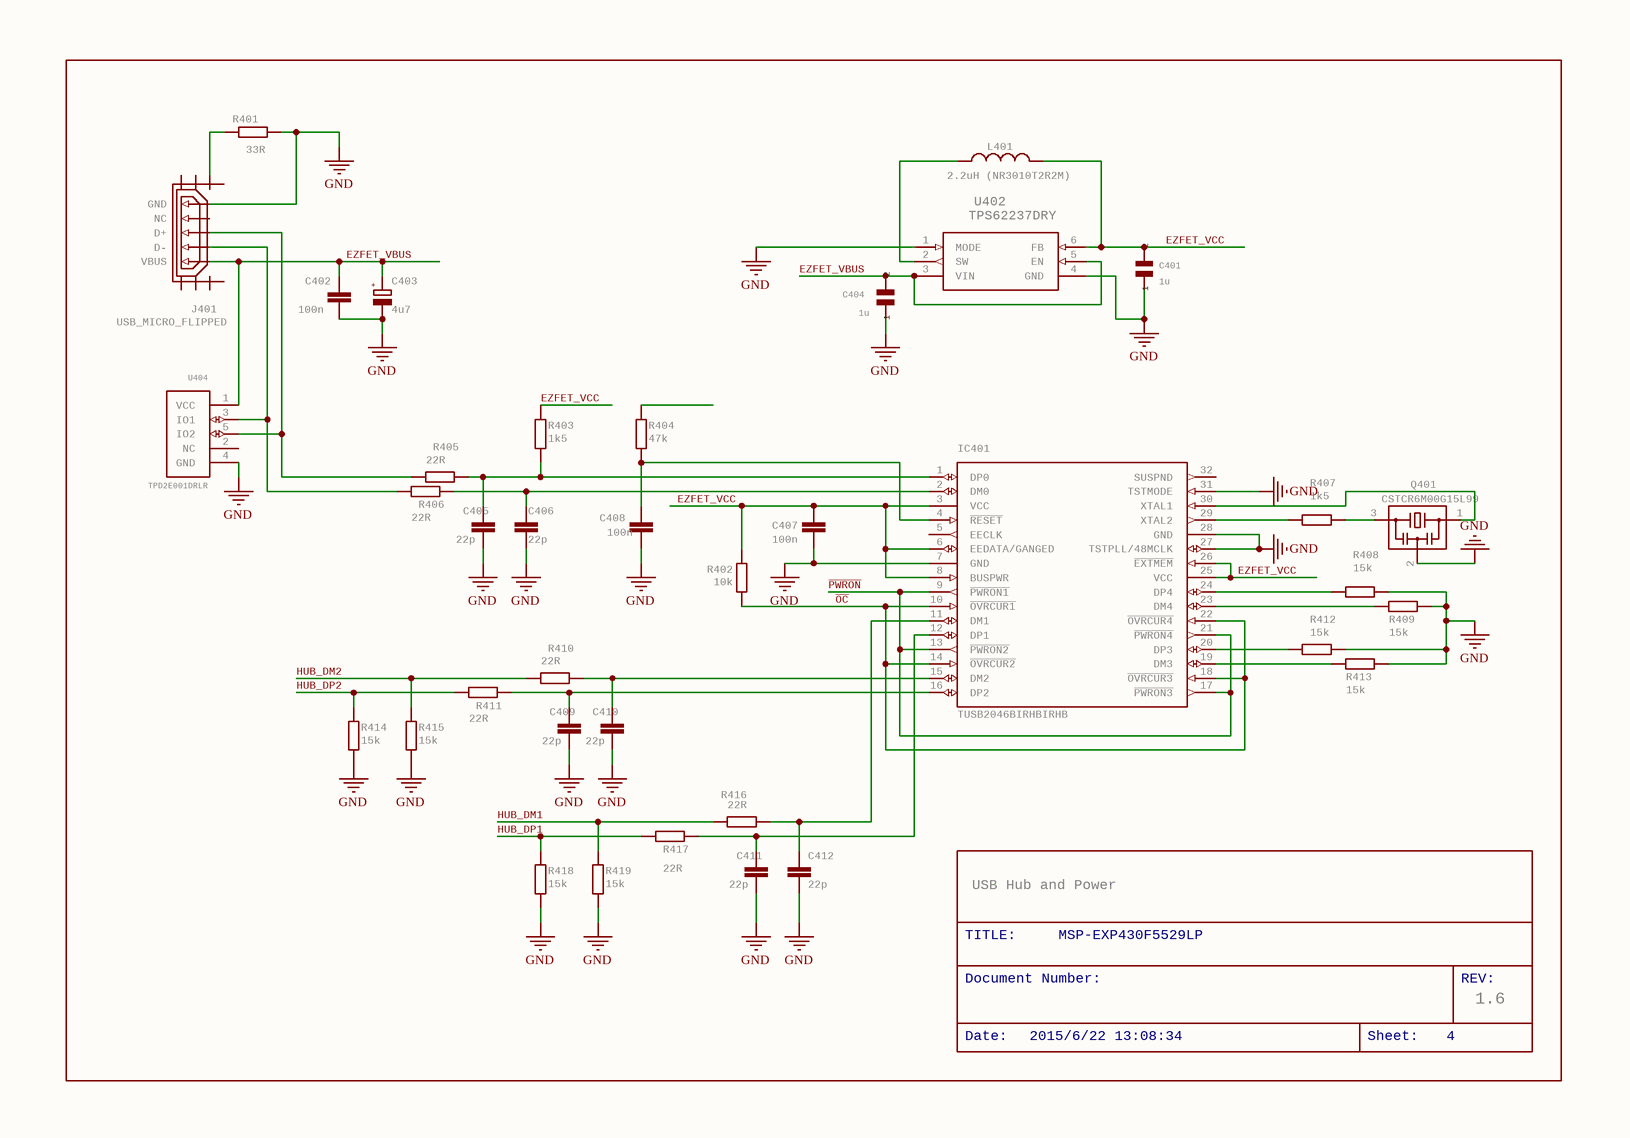
[diagram p3: MSP-EXP430F5529LP_3.SchDoc]

### Parts
C401  1u  [CSMD0805]
C402  100n  [0402]
C403  4u7  [A/3216-18R]
C404  1u  [CSMD0805]
C405  22p  [0402]
C406  22p  [0402]
C407  100n  [0402]
C408  100n  [0402]
C409  22p  [0402]
C410  22p  [0402]
C411  22p  [0402]
C412  22p  [0402]
IC401  TUSB2046BIRHBIRHB  [RHB_S-PQFP-N32]
J401  USB_MICRO_FLIPPED  [HIROSE-ZX62R-B-5P]
L401  2.2uH (NR3010T2R2M)  [L-NR3010]
Q401  CSTCR6M00G15L99  [MURATA-FILTER_CSTCR]
R401  33R  [0402]
R402  10k  [0402]
R403  1k5  [0402]
R404  47k  [0402]
R405  22R  [0402]
R406  22R  [0402]
R407  1k5  [0402]
R408  15k  [0402]
R409  15k  [0402]
R410  22R  [0402]
R411  22R  [0402]
R412  15k  [0402]
R413  15k  [0402]
R414  15k  [0402]
R415  15k  [0402]
R416  22R  [0402]
R417  22R  [0402]
R418  15k  [0402]
R419  15k  [0402]
U402  TPS62237DRY  [DRY6]
U404  TPD2E001DRLR  [TPD2E001-DRL]

### Nets
GND: C401.1 C402.2 C403.- C404.1 C405.2 C406.2 C407.2 C408.2 C409.2 C410.2 C411.2 C412.2 IC401.7(GND) IC401.27(TSTPLL/48MCLK) IC401.28(GND) IC401.31(TSTMODE) J401.GND Q401.2 R401.2 R408.1 R409.1 R412.1 R413.1 R414.2 R415.2 R418.2 R419.2 U402.1(MODE) U402.4(GND) U404.4(GND)
EZFET_VBUS: C402.1 C403.+ C404.2 J401.VBUS U402.3(VIN) U402.5(EN) U404.1(VCC)
EZFET_VCC: C401.2 C407.1 IC401.3(VCC) IC401.6(EEDATA/GANGED) IC401.8(BUSPWR) IC401.25(VCC) IC401.26(~{EXTMEM}) L401.P$2 R402.1 R403.1 U402.6(FB)
HUB_DM1: R416.2 R419.1
HUB_DM2: R410.2 R415.1
HUB_DP1: R417.2 R418.1
HUB_DP2: R411.2 R414.1
~{OC}: IC401.10(~{OVRCUR1}) IC401.14(~{OVRCUR2}) IC401.18(~{OVRCUR3}) IC401.22(~{OVRCUR4}) R402.2
~{PWRON}: IC401.9(~{PWRON1}) IC401.13(~{PWRON2}) IC401.17(~{PWRON3}) IC401.21(~{PWRON4})
NetC405_1: C405.1 IC401.1(DP0) R403.2 R405.1
NetC406_1: C406.1 IC401.2(DM0) R406.1
NetC408_1: C408.1 IC401.4(~{RESET}) R404.2
NetC409_1: C409.1 IC401.16(DP2) R411.1
NetC410_1: C410.1 IC401.15(DM2) R410.1
NetC411_1: C411.1 IC401.12(DP1) R417.1
NetC412_1: C412.1 IC401.11(DM1) R416.1
NetIC401_19: IC401.19(DM3) R413.2
NetIC401_20: IC401.20(DP3) R412.2
NetIC401_23: IC401.23(DM4) R409.2
NetIC401_24: IC401.24(DP4) R408.2
NetIC401_29: IC401.29(XTAL2) R407.2
NetIC401_30: IC401.30(XTAL1) Q401.1
NetJ401_D+: J401.D+ R405.2 U404.5(IO2)
NetJ401_D-: J401.D- R406.2 U404.3(IO1)
NetJ401_SHIELD1: J401.SHIELD1 R401.1
NetL401_P$1: L401.P$1 U402.2(SW)
NetQ401_3: Q401.3 R407.1

Not connected (* = marked no-connect by the designer): IC401 5(EECLK) 32(SUSPND); J401 NC SHIELD2 SHIELD3 SHIELD4 SHIELD5 SHIELD6; R404 1; U404 2(NC)

### Notes on the sheet
- TITLE:
- USB Hub and Power
- MSP-EXP430F5529LP
- Document Number:
- REV:
- 1.6
- Date:
- 2015/6/22 13:08:34
- Sheet:
- 4

### Library data of the parts
C401 C404 = CSMD0805: GateName_1: G$2; SymbolName_1: C; LibraryName: CAP; DeviceSetName: CSMD0805; 1: 1; 2: 2
C402 C405-C412 = C-EUCM0402: as C14 on sheet MSP-EXP430F5529LP_0; LibraryName: rcl; DeviceSetName: C-EU
C403 = CPOL-EUA/3216-18R: as C27 on sheet MSP-EXP430F5529LP_0; DeviceName: A/3216-18R; LibraryName: rcl; DeviceSetName: CPOL-EU; +: +
IC401 = TUSB2046BIRHBIRHB: 4-PORT HUB FOR THE UNIVERSAL SERIAL BUS WITH OPTIONAL SERIAL EEPROM INTERFACE   Source: http://focus.ti.com/lit/ds/symlink/tusb2046b.pdf; MPN: TUSB2046BIRHBT; GateName_1: G$1; DeviceName: IRHB; SymbolName_1: TUSB2046B; LibraryName: texas; DeviceSetName: TUSB2046BIRHB; MF: MF; OC_FARNELL: 1610201; OC_NEWARK: 14N8499
J401 = USB_MICRO_FLIPPED: GateName_1: G$1; SymbolName_1: MICRO_USB_6_SHIELD; LibraryName: usb_con-update; DeviceSetName: USB_MICRO_FLIPPED
L401 = L-NR3010: GateName_1: G$1; SymbolName_1: L-US; LibraryName: MSP-EXP430F5659; DeviceSetName: L-NR3010
Q401 = MURATA-FILTER_CSTCR: as Q4 on sheet MSP-EXP430F5529LP_0; SymbolName_1: MURATA-FILTER_CST; LibraryName: murata; DeviceSetName: MURATA-FILTER_CSTCR; MF: MF; OC_FARNELL: 1170434; OC_NEWARK: 25M8759
R401-R419 = R-EU_RM0402: as R14 on sheet MSP-EXP430F5529LP_0; LibraryName: rcl
U402 = TPS6223X_DRY_6: GENERIC_PART_NUMBER: TPS62231; MANUFACTURER: Texas Instruments; MANUFACTURER_PART_NUMBER: tps62231_dry_6; GateName_1: >NAME; DESCRIPTION: 3 MHz Ultra Small Step Down Converter in 1x1.5 SON Package; FAMILY_NAME: STEP-DOWN REGULATOR; INDUSTRY_STD_PKG_TYPE: SON; PACKAGE_DESIGNATOR: DRY; PIN_COUNT: 6; VENDOR: Texas Instuments; SymbolName_1: TPS6223X_DRY_6; LibraryName: tps62231dry; DeviceSetName: TPS6223X_DRY_6; DATASHEETURL: http://www.ti.com/lit/gpn/TPS62231
U404 = TPD2E001: TPD2E001 ESD-protection diode array; GateName_1: A; SymbolName_1: TPD2E001; LibraryName: Project7264; DeviceSetName: TPD2E001

## Nets that join several sheets
+3V3: MSP-EXP430F5529LP_0 (8 pins), MSP-EXP430F5529LP_1 (5 pins)
+5V: MSP-EXP430F5529LP_0 (C27.+ U6.65), MSP-EXP430F5529LP_1 (5 pins)
GND: MSP-EXP430F5529LP_0 (22 pins), MSP-EXP430F5529LP_1 (16 pins), MSP-EXP430F5529LP_2 (25 pins), MSP-EXP430F5529LP_3 (30 pins)
EZFET_SBW_NC: MSP-EXP430F5529LP_1 (JP4.3.1), MSP-EXP430F5529LP_2 (MSP101.45)
EZFET_SBW_RST: MSP-EXP430F5529LP_1 (JP4.2.1), MSP-EXP430F5529LP_2 (MSP101.43)
EZFET_SBW_TST: MSP-EXP430F5529LP_1 (JP4.1.1), MSP-EXP430F5529LP_2 (MSP101.44)
EZFET_UARTCTS: MSP-EXP430F5529LP_1 (JP6.4.1), MSP-EXP430F5529LP_2 (MSP101.32)
EZFET_UARTRTS: MSP-EXP430F5529LP_1 (JP6.3.1), MSP-EXP430F5529LP_2 (MSP101.33)
EZFET_UARTRXD: MSP-EXP430F5529LP_1 (JP6.1.1), MSP-EXP430F5529LP_2 (MSP101.38)
EZFET_UARTTXD: MSP-EXP430F5529LP_1 (JP6.2.1), MSP-EXP430F5529LP_2 (MSP101.37)
EZFET_VBUS: MSP-EXP430F5529LP_1 (JP1.1), MSP-EXP430F5529LP_2 (MSP101.53 R124.1), MSP-EXP430F5529LP_3 (7 pins)
EZFET_VCC: MSP-EXP430F5529LP_1 (JP2.1), MSP-EXP430F5529LP_2 (8 pins), MSP-EXP430F5529LP_3 (11 pins)
HUB_DM1: MSP-EXP430F5529LP_0 (R31.1), MSP-EXP430F5529LP_3 (R416.2 R419.1)
HUB_DM2: MSP-EXP430F5529LP_2 (R103.1), MSP-EXP430F5529LP_3 (R410.2 R415.1)
HUB_DP1: MSP-EXP430F5529LP_0 (R32.1), MSP-EXP430F5529LP_3 (R417.2 R418.1)
HUB_DP2: MSP-EXP430F5529LP_2 (R104.1), MSP-EXP430F5529LP_3 (R411.2 R414.1)
P1.0: MSP-EXP430F5529LP_0 (U6.21), MSP-EXP430F5529LP_1 (JP8.1)
P1.1: MSP-EXP430F5529LP_0 (U6.22), MSP-EXP430F5529LP_1 (S2.1)
P1.2: MSP-EXP430F5529LP_0 (U6.23), MSP-EXP430F5529LP_1 (J5.11)
P1.3: MSP-EXP430F5529LP_0 (U6.24), MSP-EXP430F5529LP_1 (J5.9)
P1.4: MSP-EXP430F5529LP_0 (U6.25), MSP-EXP430F5529LP_1 (J5.7)
P1.5: MSP-EXP430F5529LP_0 (U6.26), MSP-EXP430F5529LP_1 (J5.5)
P1.6: MSP-EXP430F5529LP_0 (U6.27), MSP-EXP430F5529LP_1 (J1.9)
P1.7: MSP-EXP430F5529LP_0 (U6.28), MSP-EXP430F5529LP_1 (JP6.3.2)
P2.0: MSP-EXP430F5529LP_0 (U6.29), MSP-EXP430F5529LP_1 (J5.4)
P2.1: MSP-EXP430F5529LP_0 (U6.30), MSP-EXP430F5529LP_1 (S1.1)
P2.2: MSP-EXP430F5529LP_0 (U6.31), MSP-EXP430F5529LP_1 (J5.6)
P2.3: MSP-EXP430F5529LP_0 (U6.32), MSP-EXP430F5529LP_1 (J5.18)
P2.4: MSP-EXP430F5529LP_0 (U6.33), MSP-EXP430F5529LP_1 (J5.3)
P2.5: MSP-EXP430F5529LP_0 (U6.34), MSP-EXP430F5529LP_1 (J5.1)
P2.6: MSP-EXP430F5529LP_0 (U6.35), MSP-EXP430F5529LP_1 (J5.16)
P2.7: MSP-EXP430F5529LP_0 (U6.36), MSP-EXP430F5529LP_1 (J1.15)
P3.0: MSP-EXP430F5529LP_0 (U6.37), MSP-EXP430F5529LP_1 (J5.12)
P3.1: MSP-EXP430F5529LP_0 (U6.38), MSP-EXP430F5529LP_1 (J5.14)
P3.2: MSP-EXP430F5529LP_0 (U6.39), MSP-EXP430F5529LP_1 (J1.13)
P3.3: MSP-EXP430F5529LP_0 (U6.40), MSP-EXP430F5529LP_1 (J1.7)
P3.4: MSP-EXP430F5529LP_0 (U6.41), MSP-EXP430F5529LP_1 (J1.5)
P3.5: MSP-EXP430F5529LP_0 (U6.42), MSP-EXP430F5529LP_1 (J1.20)
P3.6: MSP-EXP430F5529LP_0 (U6.43), MSP-EXP430F5529LP_1 (J1.18)
P3.7: MSP-EXP430F5529LP_0 (U6.44), MSP-EXP430F5529LP_1 (J5.17)
P4.0: MSP-EXP430F5529LP_0 (U6.45), MSP-EXP430F5529LP_1 (J5.15)
P4.1: MSP-EXP430F5529LP_0 (U6.46), MSP-EXP430F5529LP_1 (J1.19)
P4.2: MSP-EXP430F5529LP_0 (U6.47), MSP-EXP430F5529LP_1 (J1.17)
P4.3: MSP-EXP430F5529LP_0 (U6.48), MSP-EXP430F5529LP_1 (J5.13)
P4.4/UCA1TXD: MSP-EXP430F5529LP_0 (U6.51), MSP-EXP430F5529LP_1 (JP6.1.2)
P4.5/UCA1RXD: MSP-EXP430F5529LP_0 (U6.52), MSP-EXP430F5529LP_1 (JP6.2.2)
P4.7: MSP-EXP430F5529LP_0 (U6.54), MSP-EXP430F5529LP_1 (R30.1)
P6.0: MSP-EXP430F5529LP_0 (U6.77), MSP-EXP430F5529LP_1 (J1.6)
P6.1: MSP-EXP430F5529LP_0 (U6.78), MSP-EXP430F5529LP_1 (J1.8)
P6.2: MSP-EXP430F5529LP_0 (U6.79), MSP-EXP430F5529LP_1 (J1.10)
P6.3: MSP-EXP430F5529LP_0 (U6.80), MSP-EXP430F5529LP_1 (J1.12)
P6.4: MSP-EXP430F5529LP_0 (U6.1), MSP-EXP430F5529LP_1 (J1.14)
P6.5: MSP-EXP430F5529LP_0 (U6.2), MSP-EXP430F5529LP_1 (J1.3)
P6.6: MSP-EXP430F5529LP_0 (U6.3), MSP-EXP430F5529LP_1 (J1.11)
P6.7: MSP-EXP430F5529LP_0 (U6.4), MSP-EXP430F5529LP_1 (JP6.4.2)
P7.0: MSP-EXP430F5529LP_0 (U6.5), MSP-EXP430F5529LP_1 (J1.16)
P7.4: MSP-EXP430F5529LP_0 (U6.57), MSP-EXP430F5529LP_1 (J5.8)
P8.1: MSP-EXP430F5529LP_0 (U6.16), MSP-EXP430F5529LP_1 (J5.20)
P8.2: MSP-EXP430F5529LP_0 (U6.17), MSP-EXP430F5529LP_1 (J5.19)
RST/SBWTDIO: MSP-EXP430F5529LP_0 (C17.1 R27.1 S3.2 U6.76), MSP-EXP430F5529LP_1 (J5.10 JP4.2.2)
TEST/SBWTCK: MSP-EXP430F5529LP_0 (U6.71), MSP-EXP430F5529LP_1 (JP4.1.2)